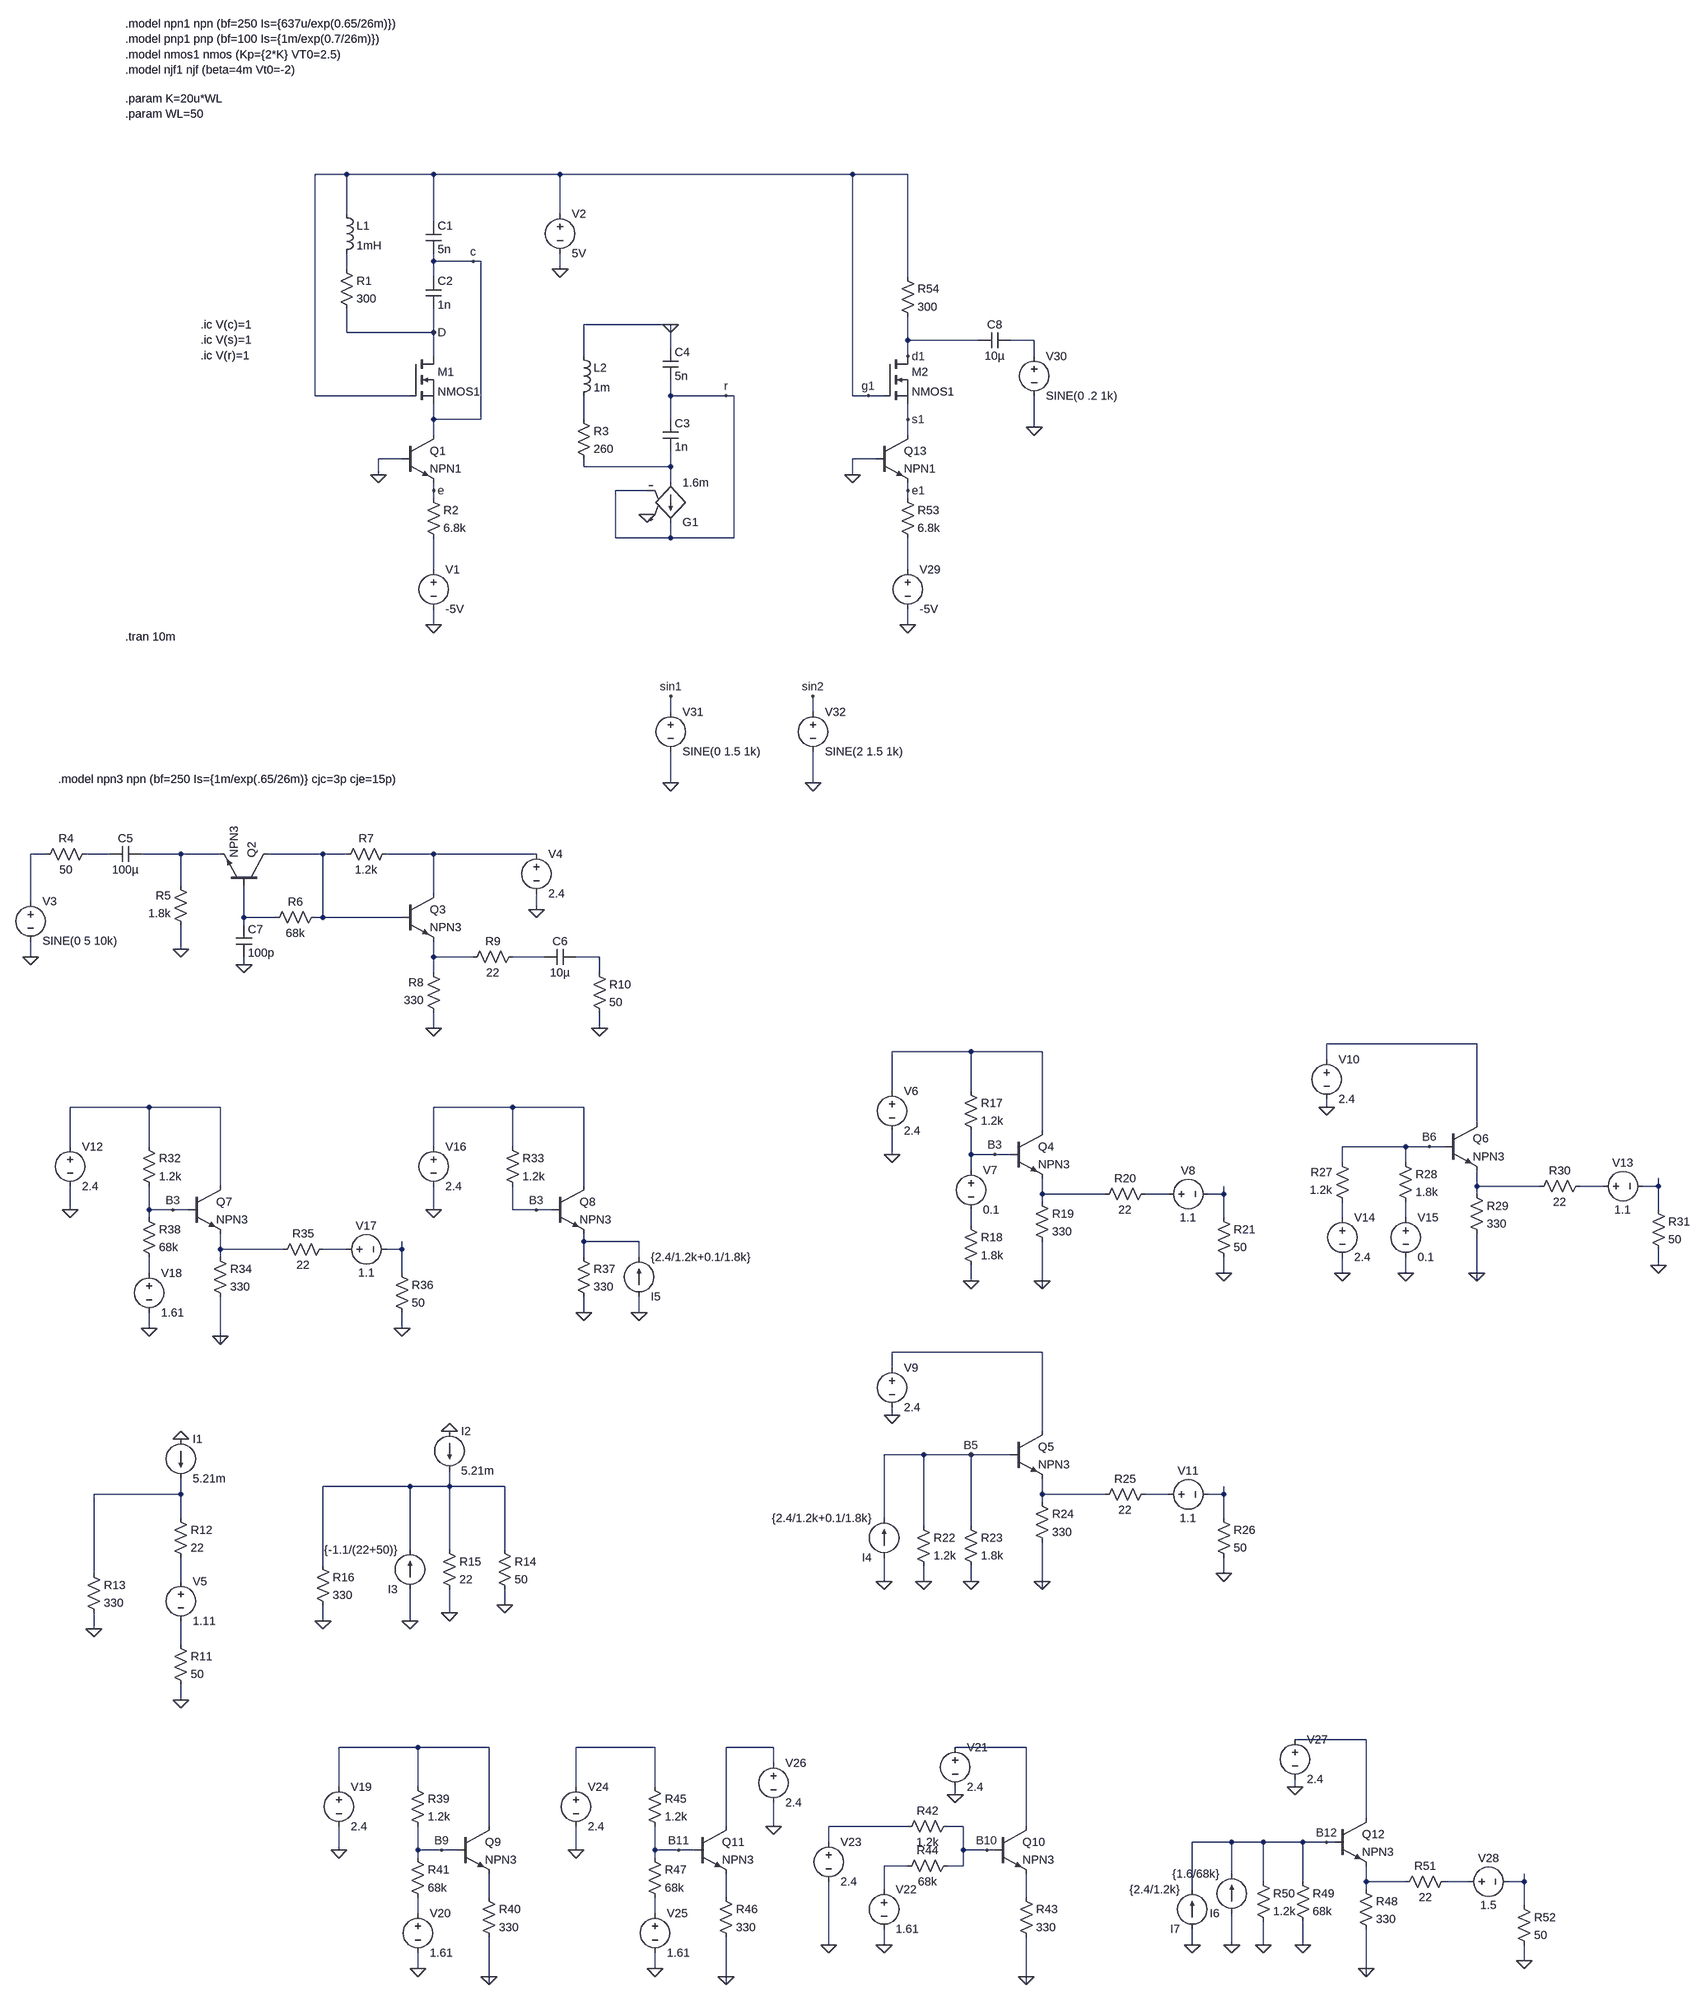
[diagram p0: schematic ss2013.asc]
ss2013.asc, the LTspice schematic file:
Version 4
SHEET 1 3032 4116
WIRE 304 432 240 432
WIRE 480 432 304 432
WIRE 736 432 480 432
WIRE 1328 432 736 432
WIRE 1440 432 1328 432
WIRE 304 512 304 432
WIRE 736 512 736 432
WIRE 480 528 480 432
WIRE 480 608 480 592
WIRE 560 608 480 608
WIRE 576 608 560 608
WIRE 304 624 304 592
WIRE 736 624 736 592
WIRE 480 640 480 608
WIRE 1440 640 1440 432
WIRE 960 736 784 736
WIRE 304 752 304 704
WIRE 480 752 480 704
WIRE 480 752 304 752
WIRE 1440 768 1440 720
WIRE 1584 768 1440 768
WIRE 1696 768 1648 768
WIRE 960 784 960 736
WIRE 480 800 480 752
WIRE 784 800 784 736
WIRE 1440 800 1440 768
WIRE 1696 800 1696 768
WIRE 240 880 240 432
WIRE 432 880 240 880
WIRE 960 880 960 848
WIRE 1072 880 960 880
WIRE 1088 880 1072 880
WIRE 1328 880 1328 432
WIRE 1360 880 1328 880
WIRE 1392 880 1360 880
WIRE 480 928 480 896
WIRE 576 928 576 608
WIRE 576 928 480 928
WIRE 784 928 784 880
WIRE 960 928 960 880
WIRE 1440 928 1440 896
WIRE 1696 944 1696 880
WIRE 480 960 480 928
WIRE 1440 960 1440 928
WIRE 416 1008 368 1008
WIRE 1376 1008 1328 1008
WIRE 784 1024 784 1008
WIRE 960 1024 960 992
WIRE 960 1024 784 1024
WIRE 368 1040 368 1008
WIRE 1328 1040 1328 1008
WIRE 960 1056 960 1024
WIRE 480 1072 480 1056
WIRE 912 1072 848 1072
WIRE 1440 1072 1440 1056
WIRE 480 1088 480 1072
WIRE 1440 1088 1440 1072
WIRE 848 1168 848 1072
WIRE 960 1168 960 1136
WIRE 960 1168 848 1168
WIRE 1088 1168 1088 880
WIRE 1088 1168 960 1168
WIRE 480 1232 480 1168
WIRE 1440 1232 1440 1168
WIRE 480 1344 480 1312
WIRE 1440 1344 1440 1312
WIRE 960 1520 960 1488
WIRE 1248 1520 1248 1488
WIRE 960 1664 960 1600
WIRE 1248 1664 1248 1600
WIRE -304 1808 -336 1808
WIRE -176 1808 -224 1808
WIRE -32 1808 -112 1808
WIRE 48 1808 -32 1808
WIRE 256 1808 144 1808
WIRE 304 1808 256 1808
WIRE 480 1808 384 1808
WIRE 688 1808 480 1808
WIRE -32 1872 -32 1808
WIRE 480 1888 480 1808
WIRE -336 1904 -336 1808
WIRE 688 1920 688 1888
WIRE 96 1936 96 1872
WIRE 160 1936 96 1936
WIRE 256 1936 256 1808
WIRE 256 1936 240 1936
WIRE 416 1936 256 1936
WIRE 96 1952 96 1936
WIRE -32 2000 -32 1952
WIRE -336 2016 -336 1984
WIRE 480 2016 480 1984
WIRE 560 2016 480 2016
WIRE 704 2016 640 2016
WIRE 816 2016 768 2016
WIRE 96 2032 96 2016
WIRE 480 2048 480 2016
WIRE 816 2048 816 2016
WIRE 480 2160 480 2128
WIRE 816 2160 816 2128
WIRE 2592 2192 2288 2192
WIRE 1568 2208 1408 2208
WIRE 1712 2208 1568 2208
WIRE 2288 2224 2288 2192
WIRE 1408 2288 1408 2208
WIRE 1568 2288 1568 2208
WIRE -96 2320 -256 2320
WIRE 48 2320 -96 2320
WIRE 640 2320 480 2320
WIRE 784 2320 640 2320
WIRE 2288 2320 2288 2304
WIRE 2592 2352 2592 2192
WIRE 1712 2368 1712 2208
WIRE -256 2400 -256 2320
WIRE -96 2400 -96 2320
WIRE 480 2400 480 2320
WIRE 640 2400 640 2320
WIRE 2448 2400 2320 2400
WIRE 2496 2400 2448 2400
WIRE 2528 2400 2496 2400
WIRE 1408 2416 1408 2368
WIRE 1568 2416 1568 2368
WIRE 1616 2416 1568 2416
WIRE 1648 2416 1616 2416
WIRE 2320 2432 2320 2400
WIRE 2448 2432 2448 2400
WIRE 1568 2448 1568 2416
WIRE 48 2480 48 2320
WIRE 784 2480 784 2320
WIRE 2592 2480 2592 2448
WIRE 2720 2480 2592 2480
WIRE 2848 2480 2800 2480
WIRE 2960 2480 2960 2464
WIRE 2960 2480 2928 2480
WIRE 1712 2496 1712 2464
WIRE 1840 2496 1712 2496
WIRE 1968 2496 1920 2496
WIRE 2080 2496 2080 2480
WIRE 2080 2496 2048 2496
WIRE 2592 2496 2592 2480
WIRE 1712 2512 1712 2496
WIRE -256 2528 -256 2480
WIRE -96 2528 -96 2480
WIRE -48 2528 -96 2528
WIRE -16 2528 -48 2528
WIRE 480 2528 480 2480
WIRE 640 2528 640 2480
WIRE 688 2528 640 2528
WIRE 720 2528 688 2528
WIRE 2960 2528 2960 2480
WIRE -96 2544 -96 2528
WIRE 2080 2544 2080 2496
WIRE 2320 2544 2320 2512
WIRE 2448 2544 2448 2512
WIRE 1568 2560 1568 2528
WIRE 784 2592 784 2576
WIRE 896 2592 784 2592
WIRE 48 2608 48 2576
WIRE 176 2608 48 2608
WIRE 304 2608 256 2608
WIRE 416 2608 416 2592
WIRE 416 2608 384 2608
WIRE 48 2624 48 2608
WIRE 784 2624 784 2592
WIRE 896 2624 896 2592
WIRE 2960 2640 2960 2608
WIRE -96 2656 -96 2624
WIRE 416 2656 416 2608
WIRE 2080 2656 2080 2624
WIRE 2320 2656 2320 2624
WIRE 2448 2656 2448 2624
WIRE 2592 2656 2592 2576
WIRE 1568 2672 1568 2640
WIRE 1712 2672 1712 2592
WIRE 2592 2672 2592 2656
WIRE 1712 2688 1712 2672
WIRE 784 2736 784 2704
WIRE 896 2736 896 2704
WIRE -96 2768 -96 2736
WIRE 416 2768 416 2736
WIRE 48 2784 48 2704
WIRE 48 2800 48 2784
WIRE 1712 2816 1408 2816
WIRE 1408 2848 1408 2816
WIRE 1408 2944 1408 2928
WIRE 1712 2976 1712 2816
WIRE 1472 3024 1392 3024
WIRE 1568 3024 1472 3024
WIRE 1648 3024 1568 3024
WIRE 432 3088 256 3088
WIRE 512 3088 512 3056
WIRE 512 3088 432 3088
WIRE 624 3088 512 3088
WIRE -32 3104 -32 3072
WIRE -32 3104 -208 3104
WIRE 1712 3104 1712 3072
WIRE 1840 3104 1712 3104
WIRE 1968 3104 1920 3104
WIRE 2080 3104 2080 3088
WIRE 2080 3104 2048 3104
WIRE 1712 3120 1712 3104
WIRE -32 3152 -32 3104
WIRE 1392 3152 1392 3024
WIRE 2080 3152 2080 3104
WIRE 1472 3168 1472 3024
WIRE 1568 3168 1568 3024
WIRE 432 3216 432 3088
WIRE 512 3216 512 3088
WIRE 624 3216 624 3088
WIRE 256 3248 256 3088
WIRE -208 3264 -208 3104
WIRE 2080 3264 2080 3232
WIRE -32 3280 -32 3232
WIRE 1392 3280 1392 3232
WIRE 1472 3280 1472 3248
WIRE 1568 3280 1568 3248
WIRE 1712 3280 1712 3200
WIRE 1712 3296 1712 3280
WIRE 624 3328 624 3296
WIRE 512 3344 512 3296
WIRE 256 3360 256 3328
WIRE 432 3360 432 3296
WIRE -208 3376 -208 3344
WIRE -32 3408 -32 3360
WIRE -32 3520 -32 3488
WIRE 2368 3600 2224 3600
WIRE 448 3616 288 3616
WIRE 592 3616 448 3616
WIRE 928 3616 768 3616
WIRE 1168 3616 1072 3616
WIRE 1680 3616 1536 3616
WIRE 1168 3648 1168 3616
WIRE 288 3696 288 3616
WIRE 448 3696 448 3616
WIRE 768 3696 768 3616
WIRE 928 3696 928 3616
WIRE 2224 3696 2224 3680
WIRE 1536 3712 1536 3696
WIRE 2368 3760 2368 3600
WIRE 592 3776 592 3616
WIRE 1072 3776 1072 3616
WIRE 1168 3776 1168 3728
WIRE 1440 3776 1280 3776
WIRE 1552 3776 1520 3776
WIRE 1680 3776 1680 3616
WIRE 1280 3808 1280 3776
WIRE 2096 3808 2016 3808
WIRE 2160 3808 2096 3808
WIRE 2240 3808 2160 3808
WIRE 2288 3808 2240 3808
WIRE 2304 3808 2288 3808
WIRE 288 3824 288 3776
WIRE 448 3824 448 3776
WIRE 496 3824 448 3824
WIRE 528 3824 496 3824
WIRE 768 3824 768 3776
WIRE 928 3824 928 3776
WIRE 976 3824 928 3824
WIRE 1008 3824 976 3824
WIRE 1552 3824 1552 3776
WIRE 1600 3824 1552 3824
WIRE 1616 3824 1600 3824
WIRE 448 3840 448 3824
WIRE 928 3840 928 3824
WIRE 1440 3856 1392 3856
WIRE 1552 3856 1552 3824
WIRE 1552 3856 1520 3856
WIRE 2096 3872 2096 3808
WIRE 2160 3888 2160 3808
WIRE 2240 3888 2240 3808
WIRE 2368 3888 2368 3856
WIRE 2448 3888 2368 3888
WIRE 2576 3888 2528 3888
WIRE 2688 3888 2688 3872
WIRE 2688 3888 2656 3888
WIRE 1392 3904 1392 3856
WIRE 2016 3904 2016 3808
WIRE 2368 3904 2368 3888
WIRE 592 3920 592 3872
WIRE 1072 3920 1072 3872
WIRE 1680 3920 1680 3872
WIRE 2688 3936 2688 3888
WIRE 448 3952 448 3920
WIRE 928 3952 928 3920
WIRE 1280 4016 1280 3888
WIRE 1392 4016 1392 3984
WIRE 2016 4016 2016 3984
WIRE 2096 4016 2096 3952
WIRE 2160 4016 2160 3968
WIRE 2240 4016 2240 3968
WIRE 2688 4048 2688 4016
WIRE 448 4064 448 4032
WIRE 928 4064 928 4032
WIRE 2368 4064 2368 3984
WIRE 592 4080 592 4000
WIRE 1072 4080 1072 4000
WIRE 1680 4080 1680 4000
WIRE 2368 4080 2368 4064
WIRE 592 4096 592 4080
WIRE 1072 4096 1072 4080
WIRE 1680 4096 1680 4080
FLAG 736 624 0
FLAG 480 1344 0
FLAG 368 1040 0
FLAG 560 608 c
FLAG 480 752 D
FLAG 480 1072 e
FLAG 960 736 0
FLAG 912 1120 0
FLAG 1072 880 r
FLAG 816 2160 0
FLAG 480 2160 0
FLAG -336 2016 0
FLAG -32 2000 0
FLAG 96 2032 0
FLAG 688 1920 0
FLAG -32 3520 0
FLAG -208 3376 0
FLAG -32 2992 0
FLAG 624 3328 0
FLAG 256 3360 0
FLAG 512 2976 0
FLAG 432 3360 0
FLAG 512 3344 0
FLAG 1568 2672 0
FLAG 1712 2672 0
FLAG 1408 2416 0
FLAG 2080 2656 0
FLAG 1568 3280 0
FLAG 1712 3280 0
FLAG 1408 2944 0
FLAG 2080 3264 0
FLAG 1392 3280 0
FLAG 1472 3280 0
FLAG 1616 2416 B3
FLAG 1568 3024 B5
FLAG 2448 2656 0
FLAG 2592 2656 0
FLAG 2288 2320 0
FLAG 2960 2640 0
FLAG 2496 2400 B6
FLAG 2320 2656 0
FLAG 48 2784 0
FLAG -256 2528 0
FLAG 416 2768 0
FLAG -48 2528 B3
FLAG 784 2736 0
FLAG 480 2528 0
FLAG 688 2528 B3
FLAG 896 2736 0
FLAG -96 2768 0
FLAG 592 4080 0
FLAG 288 3824 0
FLAG 496 3824 B9
FLAG 448 4064 0
FLAG 1680 4080 0
FLAG 1536 3712 0
FLAG 1280 4016 0
FLAG 1392 4016 0
FLAG 1072 4080 0
FLAG 768 3824 0
FLAG 976 3824 B11
FLAG 928 4064 0
FLAG 1168 3776 0
FLAG 1600 3824 B10
FLAG 2368 4064 0
FLAG 2224 3696 0
FLAG 2288 3808 B12
FLAG 2016 4016 0
FLAG 2096 4016 0
FLAG 2160 4016 0
FLAG 2240 4016 0
FLAG 2688 4048 0
FLAG 1440 1344 0
FLAG 1328 1040 0
FLAG 1696 944 0
FLAG 1360 880 g1
FLAG 1440 928 s1
FLAG 1440 1072 e1
FLAG 1440 800 d1
FLAG 960 1664 0
FLAG 960 1488 sin1
FLAG 1248 1664 0
FLAG 1248 1488 sin2
SYMBOL ind 288 496 R0
SYMATTR InstName L1
SYMATTR Value 1mH
SYMBOL res 288 608 R0
SYMATTR InstName R1
SYMATTR Value 300
SYMBOL cap 464 528 R0
SYMATTR InstName C1
SYMATTR Value 5n
SYMBOL cap 464 640 R0
SYMATTR InstName C2
SYMATTR Value 1n
SYMBOL nmos 432 800 R0
SYMATTR InstName M1
SYMATTR Value NMOS1
SYMBOL npn 416 960 R0
SYMATTR InstName Q1
SYMATTR Value NPN1
SYMBOL res 464 1072 R0
SYMATTR InstName R2
SYMATTR Value 6.8k
SYMBOL voltage 480 1216 R0
WINDOW 123 0 0 Left 2
WINDOW 39 0 0 Left 2
SYMATTR InstName V1
SYMATTR Value -5V
SYMBOL voltage 736 496 R0
SYMATTR InstName V2
SYMATTR Value 5V
SYMBOL g 960 1152 M180
SYMATTR InstName G1
SYMATTR Value 1.6m
SYMBOL cap 944 928 R0
SYMATTR InstName C3
SYMATTR Value 1n
SYMBOL cap 944 784 R0
SYMATTR InstName C4
SYMATTR Value 5n
SYMBOL res 768 912 R0
SYMATTR InstName R3
SYMATTR Value 260
SYMBOL ind 768 784 R0
SYMATTR InstName L2
SYMATTR Value 1m
SYMBOL voltage -336 1888 R0
WINDOW 123 0 0 Left 2
WINDOW 39 0 0 Left 2
SYMATTR InstName V3
SYMATTR Value SINE(0 5 10k)
SYMBOL cap -112 1792 R90
WINDOW 0 0 32 VBottom 2
WINDOW 3 32 32 VTop 2
SYMATTR InstName C5
SYMATTR Value 100µ
SYMBOL res -208 1792 R90
WINDOW 0 0 56 VBottom 2
WINDOW 3 32 56 VTop 2
SYMATTR InstName R4
SYMATTR Value 50
SYMBOL res -16 1968 R180
WINDOW 0 36 76 Left 2
WINDOW 3 36 40 Left 2
SYMATTR InstName R5
SYMATTR Value 1.8k
SYMBOL npn 144 1872 M270
SYMATTR InstName Q2
SYMATTR Value NPN3
SYMBOL npn 416 1888 R0
SYMATTR InstName Q3
SYMATTR Value NPN3
SYMBOL res 256 1920 R90
WINDOW 0 0 56 VBottom 2
WINDOW 3 32 56 VTop 2
SYMATTR InstName R6
SYMATTR Value 68k
SYMBOL res 400 1792 R90
WINDOW 0 0 56 VBottom 2
WINDOW 3 32 56 VTop 2
SYMATTR InstName R7
SYMATTR Value 1.2k
SYMBOL res 496 2144 R180
WINDOW 0 36 76 Left 2
WINDOW 3 36 40 Left 2
SYMATTR InstName R8
SYMATTR Value 330
SYMBOL res 544 2032 R270
WINDOW 0 32 56 VTop 2
WINDOW 3 0 56 VBottom 2
SYMATTR InstName R9
SYMATTR Value 22
SYMBOL cap 768 2000 R90
WINDOW 0 0 32 VBottom 2
WINDOW 3 32 32 VTop 2
SYMATTR InstName C6
SYMATTR Value 10µ
SYMBOL res 800 2032 R0
SYMATTR InstName R10
SYMATTR Value 50
SYMBOL cap 80 1952 R0
SYMATTR InstName C7
SYMATTR Value 100p
SYMBOL voltage 688 1792 R0
WINDOW 123 0 0 Left 2
WINDOW 39 0 0 Left 2
SYMATTR InstName V4
SYMATTR Value 2.4
SYMBOL voltage -32 3264 R0
WINDOW 123 0 0 Left 2
WINDOW 39 0 0 Left 2
SYMATTR InstName V5
SYMATTR Value 1.11
SYMBOL res -48 3392 R0
SYMATTR InstName R11
SYMATTR Value 50
SYMBOL res -48 3136 R0
SYMATTR InstName R12
SYMATTR Value 22
SYMBOL res -224 3248 R0
SYMATTR InstName R13
SYMATTR Value 330
SYMBOL current -32 2992 R0
WINDOW 123 0 0 Left 2
WINDOW 39 0 0 Left 2
SYMATTR InstName I1
SYMATTR Value 5.21m
SYMBOL res 608 3200 R0
SYMATTR InstName R14
SYMATTR Value 50
SYMBOL res 496 3200 R0
SYMATTR InstName R15
SYMATTR Value 22
SYMBOL res 240 3232 R0
SYMATTR InstName R16
SYMATTR Value 330
SYMBOL current 512 2976 R0
WINDOW 123 0 0 Left 2
WINDOW 39 0 0 Left 2
SYMATTR InstName I2
SYMATTR Value 5.21m
SYMBOL current 432 3296 R180
WINDOW 123 0 0 Left 2
WINDOW 39 0 0 Left 2
SYMATTR InstName I3
SYMATTR Value {-1.1/(22+50)}
SYMBOL voltage 1408 2272 R0
WINDOW 123 0 0 Left 2
WINDOW 39 0 0 Left 2
SYMATTR InstName V6
SYMATTR Value 2.4
SYMBOL npn 1648 2368 R0
SYMATTR InstName Q4
SYMATTR Value NPN3
SYMBOL res 1552 2272 R0
SYMATTR InstName R17
SYMATTR Value 1.2k
SYMBOL res 1552 2544 R0
SYMATTR InstName R18
SYMATTR Value 1.8k
SYMBOL voltage 1568 2432 R0
SYMATTR InstName V7
SYMATTR Value 0.1
SYMBOL res 1696 2496 R0
SYMATTR InstName R19
SYMATTR Value 330
SYMBOL res 1936 2480 R90
WINDOW 0 0 56 VBottom 2
WINDOW 3 32 56 VTop 2
SYMATTR InstName R20
SYMATTR Value 22
SYMBOL voltage 1952 2496 R270
WINDOW 0 32 56 VTop 2
WINDOW 3 -32 56 VBottom 2
WINDOW 123 0 0 Left 2
WINDOW 39 0 0 Left 2
SYMATTR InstName V8
SYMATTR Value 1.1
SYMBOL res 2064 2528 R0
SYMATTR InstName R21
SYMATTR Value 50
SYMBOL voltage 1408 2832 R0
WINDOW 123 0 0 Left 2
WINDOW 39 0 0 Left 2
SYMATTR InstName V9
SYMATTR Value 2.4
SYMBOL npn 1648 2976 R0
SYMATTR InstName Q5
SYMATTR Value NPN3
SYMBOL res 1456 3152 R0
SYMATTR InstName R22
SYMATTR Value 1.2k
SYMBOL res 1552 3152 R0
SYMATTR InstName R23
SYMATTR Value 1.8k
SYMBOL res 1696 3104 R0
SYMATTR InstName R24
SYMATTR Value 330
SYMBOL res 1936 3088 R90
WINDOW 0 0 56 VBottom 2
WINDOW 3 32 56 VTop 2
SYMATTR InstName R25
SYMATTR Value 22
SYMBOL voltage 1952 3104 R270
WINDOW 0 32 56 VTop 2
WINDOW 3 -32 56 VBottom 2
WINDOW 123 0 0 Left 2
WINDOW 39 0 0 Left 2
SYMATTR InstName V11
SYMATTR Value 1.1
SYMBOL res 2064 3136 R0
SYMATTR InstName R26
SYMATTR Value 50
SYMBOL current 1392 3232 R180
WINDOW 123 0 0 Left 2
WINDOW 39 0 0 Left 2
SYMATTR InstName I4
SYMATTR Value {2.4/1.2k+0.1/1.8k}
SYMBOL voltage 2288 2208 R0
WINDOW 123 0 0 Left 2
WINDOW 39 0 0 Left 2
SYMATTR InstName V10
SYMATTR Value 2.4
SYMBOL npn 2528 2352 R0
SYMATTR InstName Q6
SYMATTR Value NPN3
SYMBOL res 2336 2528 R180
WINDOW 0 36 76 Left 2
WINDOW 3 36 40 Left 2
SYMATTR InstName R27
SYMATTR Value 1.2k
SYMBOL res 2432 2416 R0
SYMATTR InstName R28
SYMATTR Value 1.8k
SYMBOL res 2576 2480 R0
SYMATTR InstName R29
SYMATTR Value 330
SYMBOL res 2816 2464 R90
WINDOW 0 0 56 VBottom 2
WINDOW 3 32 56 VTop 2
SYMATTR InstName R30
SYMATTR Value 22
SYMBOL voltage 2832 2480 R270
WINDOW 0 32 56 VTop 2
WINDOW 3 -32 56 VBottom 2
WINDOW 123 0 0 Left 2
WINDOW 39 0 0 Left 2
SYMATTR InstName V13
SYMATTR Value 1.1
SYMBOL res 2944 2512 R0
SYMATTR InstName R31
SYMATTR Value 50
SYMBOL voltage 2320 2528 R0
WINDOW 123 0 0 Left 2
WINDOW 39 0 0 Left 2
SYMATTR InstName V14
SYMATTR Value 2.4
SYMBOL voltage 2448 2528 R0
SYMATTR InstName V15
SYMATTR Value 0.1
SYMBOL voltage -256 2384 R0
WINDOW 123 0 0 Left 2
WINDOW 39 0 0 Left 2
SYMATTR InstName V12
SYMATTR Value 2.4
SYMBOL npn -16 2480 R0
SYMATTR InstName Q7
SYMATTR Value NPN3
SYMBOL res -112 2384 R0
SYMATTR InstName R32
SYMATTR Value 1.2k
SYMBOL res 32 2608 R0
SYMATTR InstName R34
SYMATTR Value 330
SYMBOL res 272 2592 R90
WINDOW 0 0 56 VBottom 2
WINDOW 3 32 56 VTop 2
SYMATTR InstName R35
SYMATTR Value 22
SYMBOL voltage 288 2608 R270
WINDOW 0 32 56 VTop 2
WINDOW 3 -32 56 VBottom 2
WINDOW 123 0 0 Left 2
WINDOW 39 0 0 Left 2
SYMATTR InstName V17
SYMATTR Value 1.1
SYMBOL res 400 2640 R0
SYMATTR InstName R36
SYMATTR Value 50
SYMBOL voltage 480 2384 R0
WINDOW 123 0 0 Left 2
WINDOW 39 0 0 Left 2
SYMATTR InstName V16
SYMATTR Value 2.4
SYMBOL npn 720 2480 R0
SYMATTR InstName Q8
SYMATTR Value NPN3
SYMBOL res 624 2384 R0
SYMATTR InstName R33
SYMATTR Value 1.2k
SYMBOL res 768 2608 R0
SYMATTR InstName R37
SYMATTR Value 330
SYMBOL current 896 2704 M180
WINDOW 123 0 0 Left 2
WINDOW 39 0 0 Left 2
SYMATTR InstName I5
SYMATTR Value {2.4/1.2k+0.1/1.8k}
SYMBOL voltage -96 2640 R0
WINDOW 123 0 0 Left 2
WINDOW 39 0 0 Left 2
SYMATTR InstName V18
SYMATTR Value 1.61
SYMBOL res -112 2528 R0
SYMATTR InstName R38
SYMATTR Value 68k
SYMBOL voltage 288 3680 R0
WINDOW 123 0 0 Left 2
WINDOW 39 0 0 Left 2
SYMATTR InstName V19
SYMATTR Value 2.4
SYMBOL npn 528 3776 R0
SYMATTR InstName Q9
SYMATTR Value NPN3
SYMBOL res 432 3680 R0
SYMATTR InstName R39
SYMATTR Value 1.2k
SYMBOL res 576 3904 R0
SYMATTR InstName R40
SYMATTR Value 330
SYMBOL voltage 448 3936 R0
WINDOW 123 0 0 Left 2
WINDOW 39 0 0 Left 2
SYMATTR InstName V20
SYMATTR Value 1.61
SYMBOL res 432 3824 R0
SYMATTR InstName R41
SYMATTR Value 68k
SYMBOL npn 1616 3776 R0
SYMATTR InstName Q10
SYMATTR Value NPN3
SYMBOL res 1664 3904 R0
SYMATTR InstName R43
SYMATTR Value 330
SYMBOL voltage 1536 3600 R0
WINDOW 123 0 0 Left 2
WINDOW 39 0 0 Left 2
SYMATTR InstName V21
SYMATTR Value 2.4
SYMBOL res 1536 3760 R90
WINDOW 0 0 56 VBottom 2
WINDOW 3 32 56 VTop 2
SYMATTR InstName R42
SYMATTR Value 1.2k
SYMBOL res 1536 3840 R90
WINDOW 0 0 56 VBottom 2
WINDOW 3 32 56 VTop 2
SYMATTR InstName R44
SYMATTR Value 68k
SYMBOL voltage 1392 3888 R0
WINDOW 123 0 0 Left 2
WINDOW 39 0 0 Left 2
SYMATTR InstName V22
SYMATTR Value 1.61
SYMBOL voltage 1280 3792 R0
WINDOW 123 0 0 Left 2
WINDOW 39 0 0 Left 2
SYMATTR InstName V23
SYMATTR Value 2.4
SYMBOL voltage 768 3680 R0
WINDOW 123 0 0 Left 2
WINDOW 39 0 0 Left 2
SYMATTR InstName V24
SYMATTR Value 2.4
SYMBOL npn 1008 3776 R0
SYMATTR InstName Q11
SYMATTR Value NPN3
SYMBOL res 912 3680 R0
SYMATTR InstName R45
SYMATTR Value 1.2k
SYMBOL res 1056 3904 R0
SYMATTR InstName R46
SYMATTR Value 330
SYMBOL voltage 928 3936 R0
WINDOW 123 0 0 Left 2
WINDOW 39 0 0 Left 2
SYMATTR InstName V25
SYMATTR Value 1.61
SYMBOL res 912 3824 R0
SYMATTR InstName R47
SYMATTR Value 68k
SYMBOL voltage 1168 3632 R0
WINDOW 123 0 0 Left 2
WINDOW 39 0 0 Left 2
SYMATTR InstName V26
SYMATTR Value 2.4
SYMBOL npn 2304 3760 R0
SYMATTR InstName Q12
SYMATTR Value NPN3
SYMBOL res 2352 3888 R0
SYMATTR InstName R48
SYMATTR Value 330
SYMBOL voltage 2224 3584 R0
WINDOW 123 0 0 Left 2
WINDOW 39 0 0 Left 2
SYMATTR InstName V27
SYMATTR Value 2.4
SYMBOL res 2224 3872 R0
SYMATTR InstName R49
SYMATTR Value 68k
SYMBOL res 2144 3872 R0
SYMATTR InstName R50
SYMATTR Value 1.2k
SYMBOL current 2096 3952 R180
WINDOW 123 0 0 Left 2
WINDOW 39 0 0 Left 2
SYMATTR InstName I6
SYMATTR Value {1.6/68k}
SYMBOL current 2016 3984 R180
WINDOW 123 0 0 Left 2
WINDOW 39 0 0 Left 2
SYMATTR InstName I7
SYMATTR Value {2.4/1.2k}
SYMBOL res 2544 3872 R90
WINDOW 0 0 56 VBottom 2
WINDOW 3 32 56 VTop 2
SYMATTR InstName R51
SYMATTR Value 22
SYMBOL voltage 2560 3888 R270
WINDOW 0 32 56 VTop 2
WINDOW 3 -32 56 VBottom 2
WINDOW 123 0 0 Left 2
WINDOW 39 0 0 Left 2
SYMATTR InstName V28
SYMATTR Value 1.5
SYMBOL res 2672 3920 R0
SYMATTR InstName R52
SYMATTR Value 50
SYMBOL nmos 1392 800 R0
SYMATTR InstName M2
SYMATTR Value NMOS1
SYMBOL npn 1376 960 R0
SYMATTR InstName Q13
SYMATTR Value NPN1
SYMBOL res 1424 1072 R0
SYMATTR InstName R53
SYMATTR Value 6.8k
SYMBOL voltage 1440 1216 R0
WINDOW 123 0 0 Left 2
WINDOW 39 0 0 Left 2
SYMATTR InstName V29
SYMATTR Value -5V
SYMBOL res 1424 624 R0
SYMATTR InstName R54
SYMATTR Value 300
SYMBOL voltage 1696 784 R0
WINDOW 123 0 0 Left 2
WINDOW 39 0 0 Left 2
SYMATTR InstName V30
SYMATTR Value SINE(0 .2 1k)
SYMBOL cap 1648 752 R90
WINDOW 0 0 32 VBottom 2
WINDOW 3 32 32 VTop 2
SYMATTR InstName C8
SYMATTR Value 10µ
SYMBOL voltage 960 1504 R0
WINDOW 123 0 0 Left 2
WINDOW 39 0 0 Left 2
SYMATTR InstName V31
SYMATTR Value SINE(0 1.5 1k)
SYMBOL voltage 1248 1504 R0
WINDOW 123 0 0 Left 2
WINDOW 39 0 0 Left 2
SYMATTR InstName V32
SYMATTR Value SINE(2 1.5 1k)
TEXT -144 80 Left 2 !.model npn1 npn (bf=250 Is={637u/exp(0.65/26m)})\n.model pnp1 pnp (bf=100 Is={1m/exp(0.7/26m)})\n.model nmos1 nmos (Kp={2*K} VT0=2.5)\n.model njf1 njf (beta=4m Vt0=-2)
TEXT -144 1368 Left 2 !.tran 10m
TEXT 8 736 Left 2 !.ic V(c)=1\n.ic V(s)=1\n.ic V(r)=1
TEXT -280 1656 Left 2 !.model npn3 npn (bf=250 Is={1m/exp(.65/26m)} cjc=3p cje=15p)
TEXT -144 232 Left 2 !.param K=20u*WL\n.param WL=50

The netlist it stands for:
* ss2013.asc
L1 g1 N001 1mH
R1 N001 D 300
C1 g1 c 5n
C2 c D 1n
M1 D g1 c c NMOS1
Q1 c 0 e 0 NPN1
R2 e N005 6.8k
V1 N005 0 -5V
V2 g1 0 5V
G1 N004 r 0 r 1.6m
C3 r N004 1n
C4 0 r 5n
R3 N003 N004 260
L2 0 N003 1m
V3 N007 0 SINE(0 5 10k)
C5 N009 N008 100µ
R4 N008 N007 50
R5 0 N009 1.8k
Q2 N010 N012 N009 0 NPN3
Q3 N011 N010 N013 0 NPN3
R6 N010 N012 68k
R7 N011 N010 1.2k
R8 0 N013 330
R9 N013 N014 22
C6 N015 N014 10µ
R10 N015 0 50
C7 N012 0 100p
V4 N011 0 2.4
V5 N040 N041 1.11
R11 N041 0 50
R12 N036 N040 22
R13 N036 0 330
I1 0 N036 5.21m
R14 N035 0 50
R15 N035 0 22
R16 N035 0 330
I2 0 N035 5.21m
I3 0 N035 {-1.1/(22+50)}
V6 N017 0 2.4
Q4 N017 B3 N023 0 NPN3
R17 N017 B3 1.2k
R18 N028 0 1.8k
V7 B3 N028 0.1
R19 N023 0 330
R20 N024 N023 22
V8 N024 N025 1.1
R21 N025 0 50
V9 N034 0 2.4
Q5 N034 B5 N037 0 NPN3
R22 B5 0 1.2k
R23 B5 0 1.8k
R24 N037 0 330
R25 N038 N037 22
V11 N038 N039 1.1
R26 N039 0 50
I4 0 B5 {2.4/1.2k+0.1/1.8k}
V10 N016 0 2.4
Q6 N016 B6 N020 0 NPN3
R27 N026 B6 1.2k
R28 B6 N027 1.8k
R29 N020 0 330
R30 N021 N020 22
V13 N021 N022 1.1
R31 N022 0 50
V14 N026 0 2.4
V15 N027 0 0.1
V12 N018 0 2.4
Q7 N018 B3 N030 0 NPN3
R32 N018 B3 1.2k
R34 N030 0 330
R35 N031 N030 22
V17 N031 N032 1.1
R36 N032 0 50
V16 N019 0 2.4
Q8 N019 B3 N029 0 NPN3
R33 N019 B3 1.2k
R37 N029 0 330
I5 0 N029 {2.4/1.2k+0.1/1.8k}
V18 N033 0 1.61
R38 B3 N033 68k
V19 N043 0 2.4
Q9 N043 B9 N052 0 NPN3
R39 N043 B9 1.2k
R40 N052 0 330
V20 N055 0 1.61
R41 B9 N055 68k
Q10 N046 B10 N054 0 NPN3
R43 N054 0 330
V21 N046 0 2.4
R42 B10 N047 1.2k
R44 B10 N048 68k
V22 N048 0 1.61
V23 N047 0 2.4
V24 N044 0 2.4
Q11 N045 B11 N053 0 NPN3
R45 N044 B11 1.2k
R46 N053 0 330
V25 N056 0 1.61
R47 B11 N056 68k
V26 N045 0 2.4
Q12 N042 B12 N049 0 NPN3
R48 N049 0 330
V27 N042 0 2.4
R49 B12 0 68k
R50 B12 0 1.2k
I6 0 B12 {1.6/68k}
I7 0 B12 {2.4/1.2k}
R51 N050 N049 22
V28 N050 N051 1.5
R52 N051 0 50
M2 d1 g1 s1 s1 NMOS1
Q13 s1 0 e1 0 NPN1
R53 e1 N006 6.8k
V29 N006 0 -5V
R54 g1 d1 300
V30 N002 0 SINE(0 .2 1k)
C8 N002 d1 10µ
V31 sin1 0 SINE(0 1.5 1k)
V32 sin2 0 SINE(2 1.5 1k)
.model NPN NPN
.model PNP PNP
.lib standard.bjt
.model NMOS NMOS
.model PMOS PMOS
.lib standard.mos
.model npn1 npn (bf=250 Is={637u/exp(0.65/26m)})
.model pnp1 pnp (bf=100 Is={1m/exp(0.7/26m)})
.model nmos1 nmos (Kp={2*K} VT0=2.5)
.model njf1 njf (beta=4m Vt0=-2)
.tran 10m
.ic V(c)=1
.ic V(s)=1
.ic V(r)=1
.model npn3 npn (bf=250 Is={1m/exp(.65/26m)} cjc=3p cje=15p)
.param K=20u*WL
.param WL=50
.backanno
.end